# Altium schematic sheet Main.SchDoc
size 58 x 55 mm
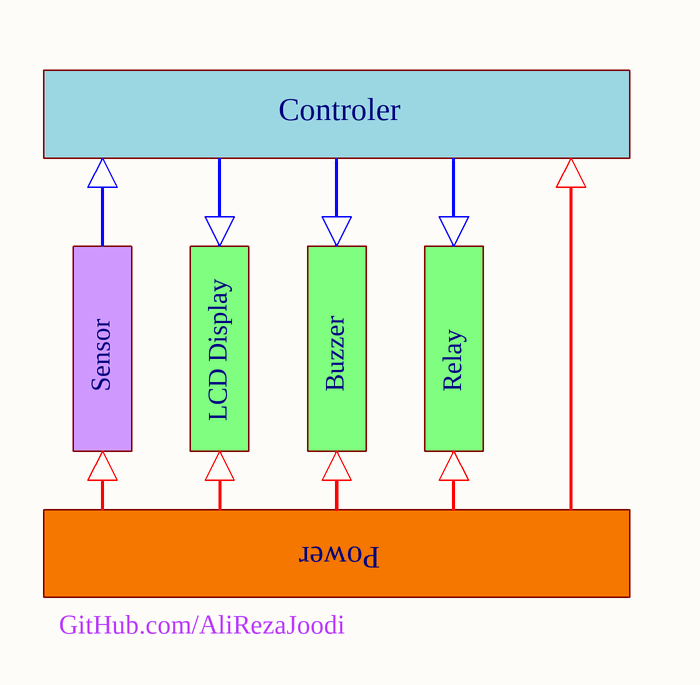
[diagram p0: Main.SchDoc]

## Sub-sheets
Buzzer = Buzzer.SchDoc: no entries
Controler = Controler.SchDoc: no entries
LCD Display = LCD Display.SchDoc: no entries
Power = Power.SchDoc: no entries
Relay = Relay.SchDoc: no entries
Sensor = Sensor.SchDoc: no entries

## Notes on the sheet
- GitHub.com/AliRezaJoodi